# Altium schematic sheet Sheet1.SchDoc (part 3 of 3)
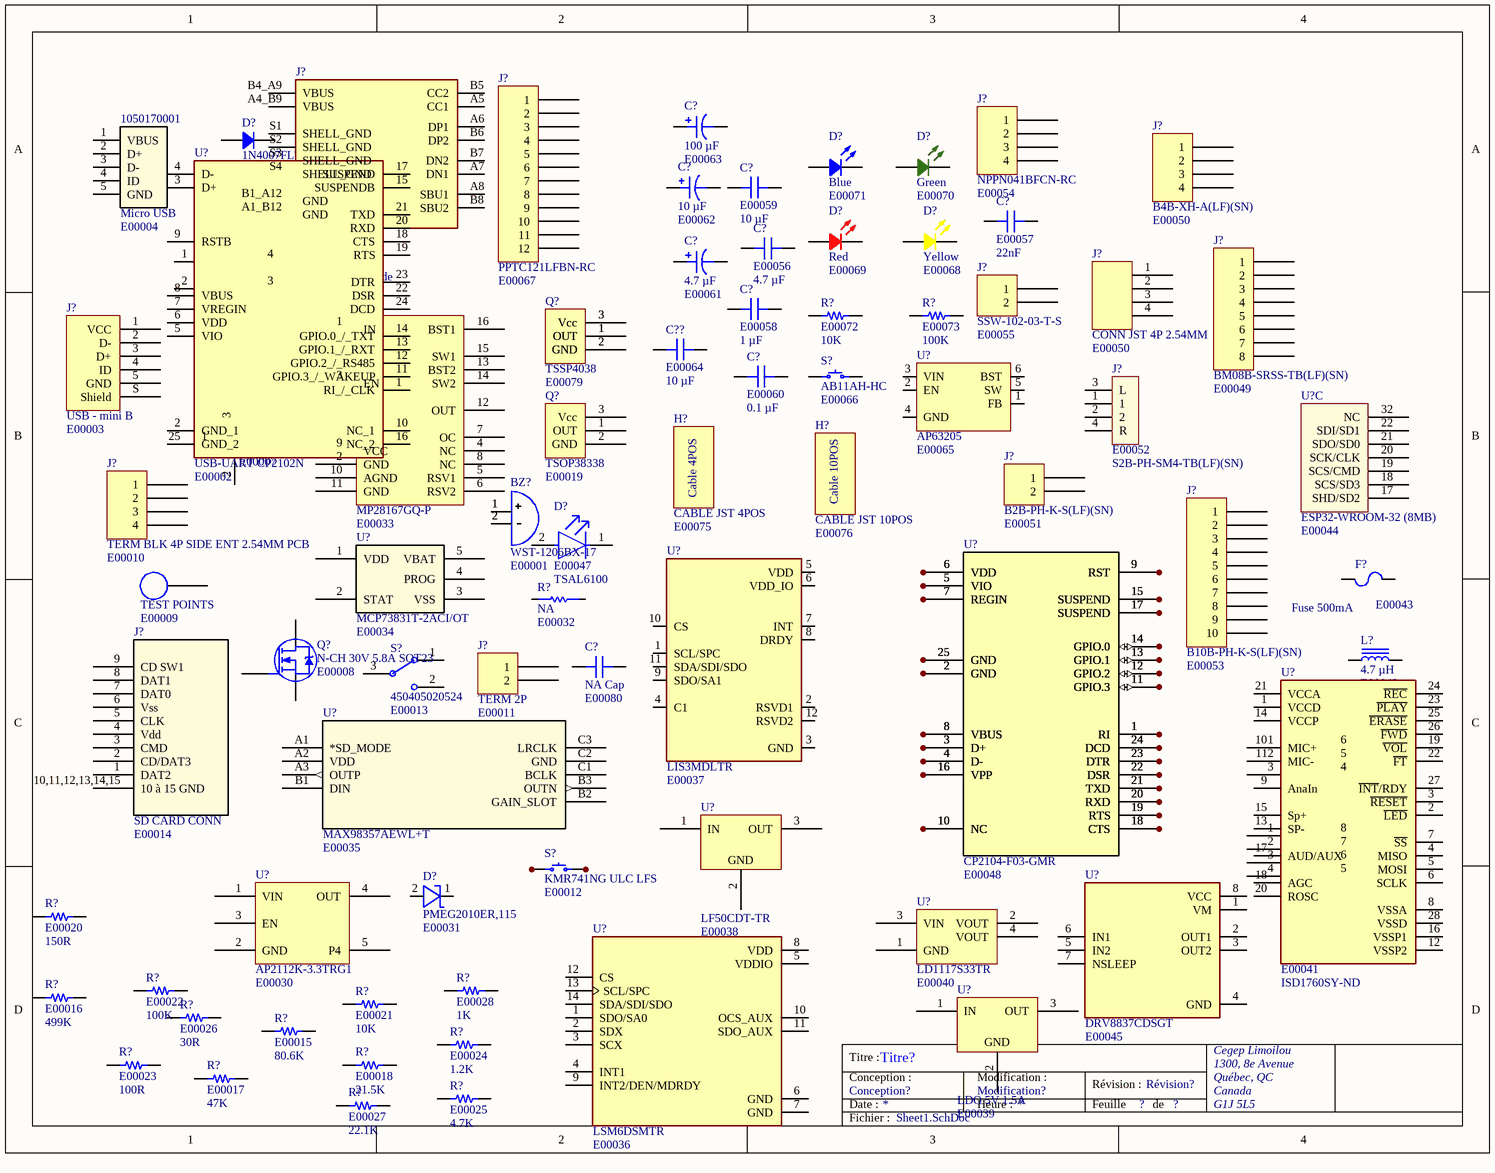
[diagram p2: Sheet1.SchDoc]

## Library data of the parts (continued)
S?#2 = SLIDE SWIT: SMT 8.7 X 3.0 MM MINI SLIDE SWIT; Manufacturer: Würth Elektronik; Rated Current: 300mA; Rated Voltage: 5VDC; Switching Function: On-On; Circuit: SPDT; Actuator Length: 2.00mm; Actuator Type: Standard; Contact Timing: Non-Shorting (BBM); Current Rating (Amps): 300mA (DC); Voltage Rating - DC: 5 V; ComponentLink1Description: Datasheet; ComponentLink1URL: https://www.we-online.com/catalog/datasheet/450405020524.pdf; ComponentLink2Description: DigiKey Link; ComponentLink2URL: https://www.digikey.com/en/products/detail/würth-elektronik/450405020524/11627297; Packaging: TapeAndReel; Publisher: Wurth Elektronik; Contact Material: Copper Alloy; Mounting Technology: SMT; Operating Temperature: -40°C ~ 85°C; Contact Plating: Silver; Manufacturer Part Number 1: 450405020524; Published Date: November 2019; Terminal Material: Copper Alloy; Size: 8.7x3mm; Terminal Plating: Silver; Contact Finish: Silver; LastUpdated: 2022-06-20 13:21:27; Lifecycle Status: Active; Minimum Order: 1; Mounting Type: Surface Mount; PartId: 4; Part Status: Active; Price: 0.73; Series: WS-SLSU; Supplier 1: DigiKey; Supplier Part Number 1: 732-450405020524CT-ND; Switch Function: On-On; Termination Style: SMD (SMT) Tab
S?#3 = Dip Switch 3P: Dip Switch SPST 3 Position Surface Mount Slide (Standard) Actuator 25mA 24VDC; Manufacturer Part Number 1: DS04-254-2-03BK-SMT; Manufacturer: CUI; Source: IC_Component.SchLib; Design Item ID: Switch SLIDE SPDT 3 pos; Component Type: Switches; Supplier 1: Mouser; Supplier Part Number 1: 653-A6S-3102-H
S?#4 = Sw Lin: SWITCH TACTILE SPST-NO 50MA 32V; Manufacturer: C&K; Actuator Height off PCB, Vertical: 2.50mm; Actuator Orientation: Top Actuated; Actuator Type: Standard; Contact Rating @ Voltage: 0.05A @ 32VDC; Illumination: Non-Illuminated; Ingress Protection: IP67 - Dust Tight, Waterproof; Operating Force: 400gf; Outline: 4.20mm x 2.80mm; Switch Function: Off-Mom; Manufacturer Part Number 1: KMR741NG ULC LFS; Circuit: SPST-NO; ComponentLink1Description: Datasheet; ComponentLink1URL: https://dznh3ojzb2azq.cloudfront.net/products/Tactile/KMR7/documents/datasheet.pdf; ComponentLink2Description: DigiKey Link; ComponentLink2URL: http://digikey.com/product-detail/en/c-k/KMR741NG-ULC-LFS/CKN10688CT-ND/6035360; LastUpdated: 2020-04-09 10:01:05; Lifecycle Status: Active; Minimum Order: 1; Mounting Type: Surface Mount; Operating Temperature: -40°C ~ 85°C; Packaging: TapeAndReel; Part Status: Active; Price: 0.16; Series: KMR7; Supplier 1: DigiKey; Supplier Part Number 1: CKN10688CT-ND; Termination Style: Gull Wing
S?#5 = Dip Switch 4P: Dip Switch SPST 4 Position Surface Mount Slide (Standard) Actuator 25mA 24VDC; Manufacturer Part Number 1: DS04-254-2-04BK-SMT; Manufacturer: CUI; Source: IC_Component.SchLib; Design Item ID: Switch SLIDE SPDT 4 pos; Component Type: Switches; Supplier 1: Digi-Key; Supplier Part Number 1: SW1120-ND
T? = TEST POINTS: RCWCTE TEST POINTS; Manufacturer Part Number 1: RCWCTE
U?#1 = AP63205: Buck Switching Regulator IC Positive Fixed 5V 1 Output 2A SOT-23-6 Thin, TSOT-23-6; Manufacturer Part Number 1: AP63205WU-7
U?#2 = MP28167GQ-P: Buck-Boost Switching Regulator IC Positive Fixed 5V 1 Output 3A 16-PowerVFQFN; Supplier 1: Digi-Key; Supplier Part Number 1: 1589-MP28167GQ-PCT-ND; Manufacturer Part Number 1: MP28167GQ-P
U?#3 = USB-UART CP2102N: USB Interface IC USBXpress - USB to UART Bridge QFN24; Manufacturer Part Number 1: CP2102N-A02-GQFN24; Manufacturer: Silicon Labs; Component Type: Interface
U?#4 = ESP32-WROOM-32 (8MB): No Description Available; Mfr_Name: Espressif Systems; Manufacturer Part Number 1: ESP32-WROOM-32D-N4; Copyright: Copyright (C) 2023 Ultra Librarian. All rights reserved.; RefDes: RefDes; Type: DEV; Supplier 1: Digi-Key; Supplier Part Number 1: 1965-ESP32-WROOM-32D-N4TR-ND
U?#5 = MCP73831T-2ACI/OT: Battery lipo charger; Mfr_Name: Honeywell; Copyright: Copyright (C) 2023 Ultra Librarian. All rights reserved.; Manufacturer Part Number 1: MCP73831T-2ACI/OT; RefDes: RefDes; Type: DEV; Supplier 1: Digi-Key; Supplier Part Number 1: MCP73831T-2ACI/OTCT-ND
U?#6 = LIS3MDLTR: Magnetoresistive Sensor X, Y, Z Axis 12-LGA (2x2); Supplier 1: Digi-Key; Supplier Part Number 1: 497-13892-1-ND; Manufacturer Part Number 1: LIS3MDLTR
U?#7 = CP2104-F03-GMR: USB TO UART CONV; Mfr_Name: Silicon Labs; Copyright: Copyright (C) 2023 Ultra Librarian. All rights reserved.; Manufacturer Part Number 1: CP2104-F03-GMR; RefDes: RefDes; Type: DEV; Supplier 1: Digi-Key; Supplier Part Number 1: 336-4146-1-ND
U?#8 = ISD1760SY: Voice Record/Playback IC Multiple Message 40 ~ 120 Sec Pushbutton, SPI 28-SOIC; Manufacturer Part Number 1: ISD1760SY; Supplier 1: Digi-Key
U?#9 = MAX98357AEWL+T: Mfr_Name: Analog Devices Inc; Copyright: Copyright (C) 2023 Ultra Librarian. All rights reserved.; Manufacturer Part Number 1: MAX98357AEWL+T; RefDes: RefDes; Type: DEV
U?#10 = LF50CDT-TR: Linear Voltage Regulator IC Positive Fixed 1 Output 500mA DPAK; Supplier 1: Digi-Key; Manufacturer Part Number 1: LF50CDT-TR; Supplier Part Number 1: 497-1534-1-ND
U?#11 = REG LIN 3.3V: REG LINEAIRE 3.3V; Manufacturer Part Number 1: AP2112K-3.3TRG1; Supplier 1: Future Electronics; Supplier Part Number 1: 8043011
U?#12 = LD1117S33TR: IC REG LINEAR 3.3V 800MA SOT223; Manufacturer: STMicroelectronics; Current - Quiescent (Iq): 10 mA; Number of Regulators: 1; Output Configuration: Positive; Output Type: Fixed; Protection Features: Over Current, Over Temperature; PSRR: 75dB (120Hz); Voltage Dropout (Max): 1.2V @ 800mA; Voltage - Input (Max): 15V; Manufacturer Part Number 1: LD1117S33TR; ComponentLink1Description: Datasheet; ComponentLink1URL: http://www.st.com/content/ccc/resource/technical/document/datasheet/99/3b/7d/91/91/51/4b/be/CD00000544.pdf/files/CD00000544.pdf/jcr:content/translations/en.CD00000544.pdf; ComponentLink2Description: DigiKey Link; ComponentLink2URL: https://www.digikey.com/en/products/detail/stmicroelectronics/LD1117S33TR/585766; Current - Output: 800mA; LastUpdated: 2023-03-27 20:01:10; Lifecycle Status: Active; Minimum Order: 1; Mounting Type: Surface Mount; Operating Temperature: 0°C ~ 125°C; Package / Case: TO-261-4, TO-261AA; Packaging: TapeAndReel; Part Status: Active; Price: 0.21; Series: -; Supplier 1: DigiKey; Supplier Part Number 1: 497-1242-1-ND; Supplier Device Package: SOT-223; Voltage - Output (Min/Fixed): 3.3V
U?#13 = DRV8837CDSGT: Motor Driver NMOS PWM 8-WSON (2x2); Supplier 1: Digi-Key; Supplier Part Number 1: 296-44747-1-ND; Manufacturer Part Number 1: DRV8837CDSGT
U?#14 = LSM6DSMTR: Accelerometer, Gyroscope, Temperature, 6 Axis Sensor I²C, SPI Output; Supplier 1: Digi-Key; Supplier Part Number 1: 497-16696-1-ND; Manufacturer Part Number 1: LSM6DSMTR
U?#15 = LDO 5V 1.5A: IC REG LINEAR 5V 1.5A DPAK; Manufacturer: STMicroelectronics; Manufacturer Part Number 1: L7805CDT-TR; Source: IC_Component.SchLib; Design Item ID: LDO 5V 1.5A; Supplier: Digi-Key; Component Type: Power Supply; Supplier 1: Digi-Key; Supplier Part Number 1: 497-7255-1-ND